# EAGLE design copy from (EAGLE 7.7.0)
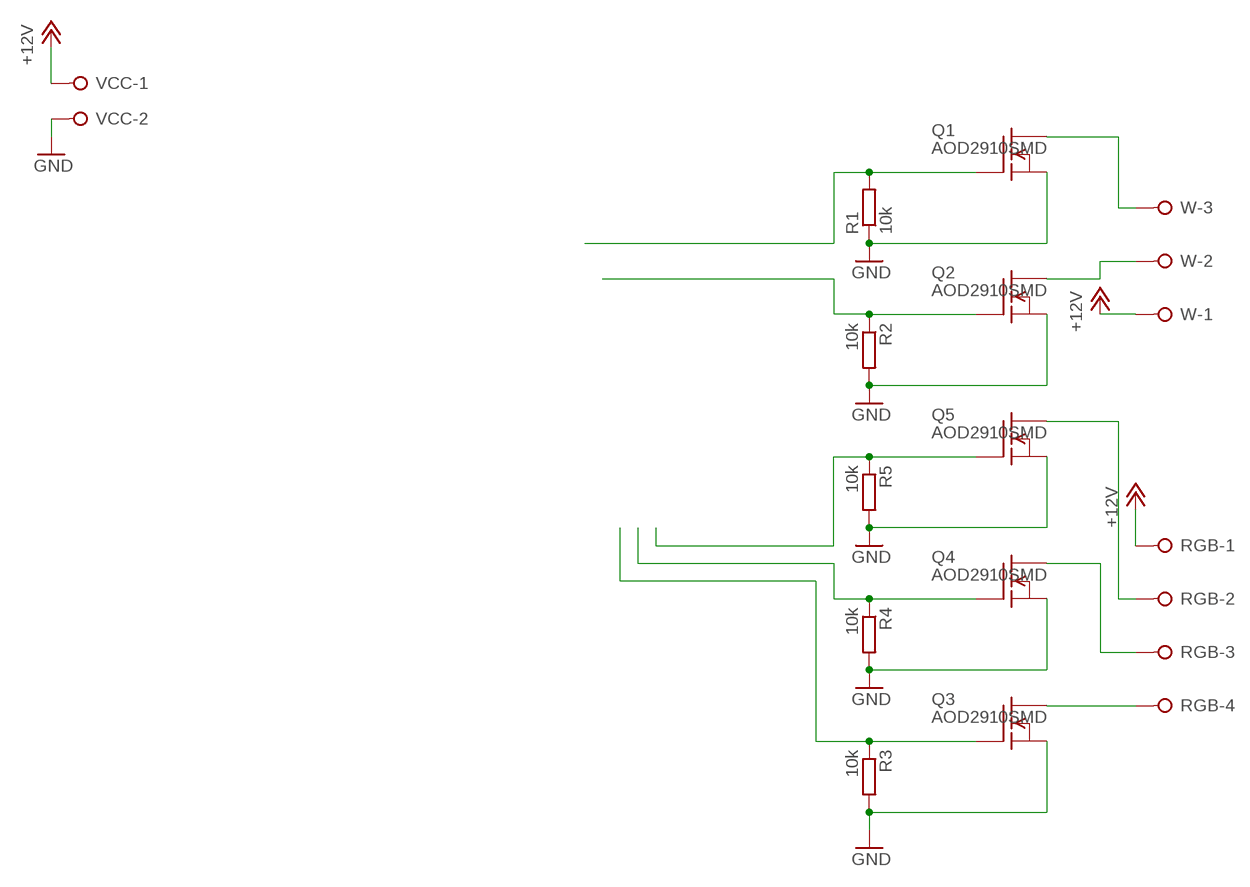
[diagram p0: schematic, sheet 1]

## Parts
Q1  AOD2910SMD  [DPAK-3]
Q2  AOD2910SMD  [DPAK-3]
Q3  AOD2910SMD  [DPAK-3]
Q4  AOD2910SMD  [DPAK-3]
Q5  AOD2910SMD  [DPAK-3]
R1  10k  R-EU_R0805  [R0805]
R2  10k  R-EU_R0805  [R0805]
R3  10k  R-EU_R0805  [R0805]
R4  10k  R-EU_R0805  [R0805]
R5  10k  R-EU_R0805  [R0805]
RGB  W237-04P  [W237-4P]
VCC  W237-02P  [W237-132]
W  W237-03P  [W237-133]

## Nets
+12V: RGB.1 VCC.1 W.1
B: Q3.4(D) RGB.4
CW: Q2.4(D) W.2
G: Q4.4(D) RGB.3
GND: Q1.3(S) Q2.3(S) Q3.3(S) Q4.3(S) Q5.3(S) R1.1 R2.2 R3.2 R4.2 R5.2 VCC.2
R: Q5.4(D) RGB.2
RGB-B: Q3.1(G) R3.1
RGB-CW: Q2.1(G) R2.1
RGB-G: Q4.1(G) R4.1
RGB-R: Q5.1(G) R5.1
RGB-WW [Signal]: Q1.1(G) R1.2
WW: Q1.4(D) W.3

## Library data of the parts
Q1-Q5 = transistor-fet+irf7201:AOD2910: N-Channel Enhancement MOSFET 100V; 32A; 0,024Ohm
R1-R5 = rcl:R-EU_: RESISTOR, European symbol
RGB = con-wago-508:W237-04P: WAGO SREW CLAMP; OC_FARNELL: unknown; OC_NEWARK: unknown
VCC = con-wago-508:W237-02P: WAGO SREW CLAMP; OC_FARNELL: unknown; OC_NEWARK: unknown
W = con-wago-508:W237-03P: WAGO SREW CLAMP; OC_FARNELL: unknown; OC_NEWARK: unknown

## Net classes
5 Signal: width 0.381 mm

## Board
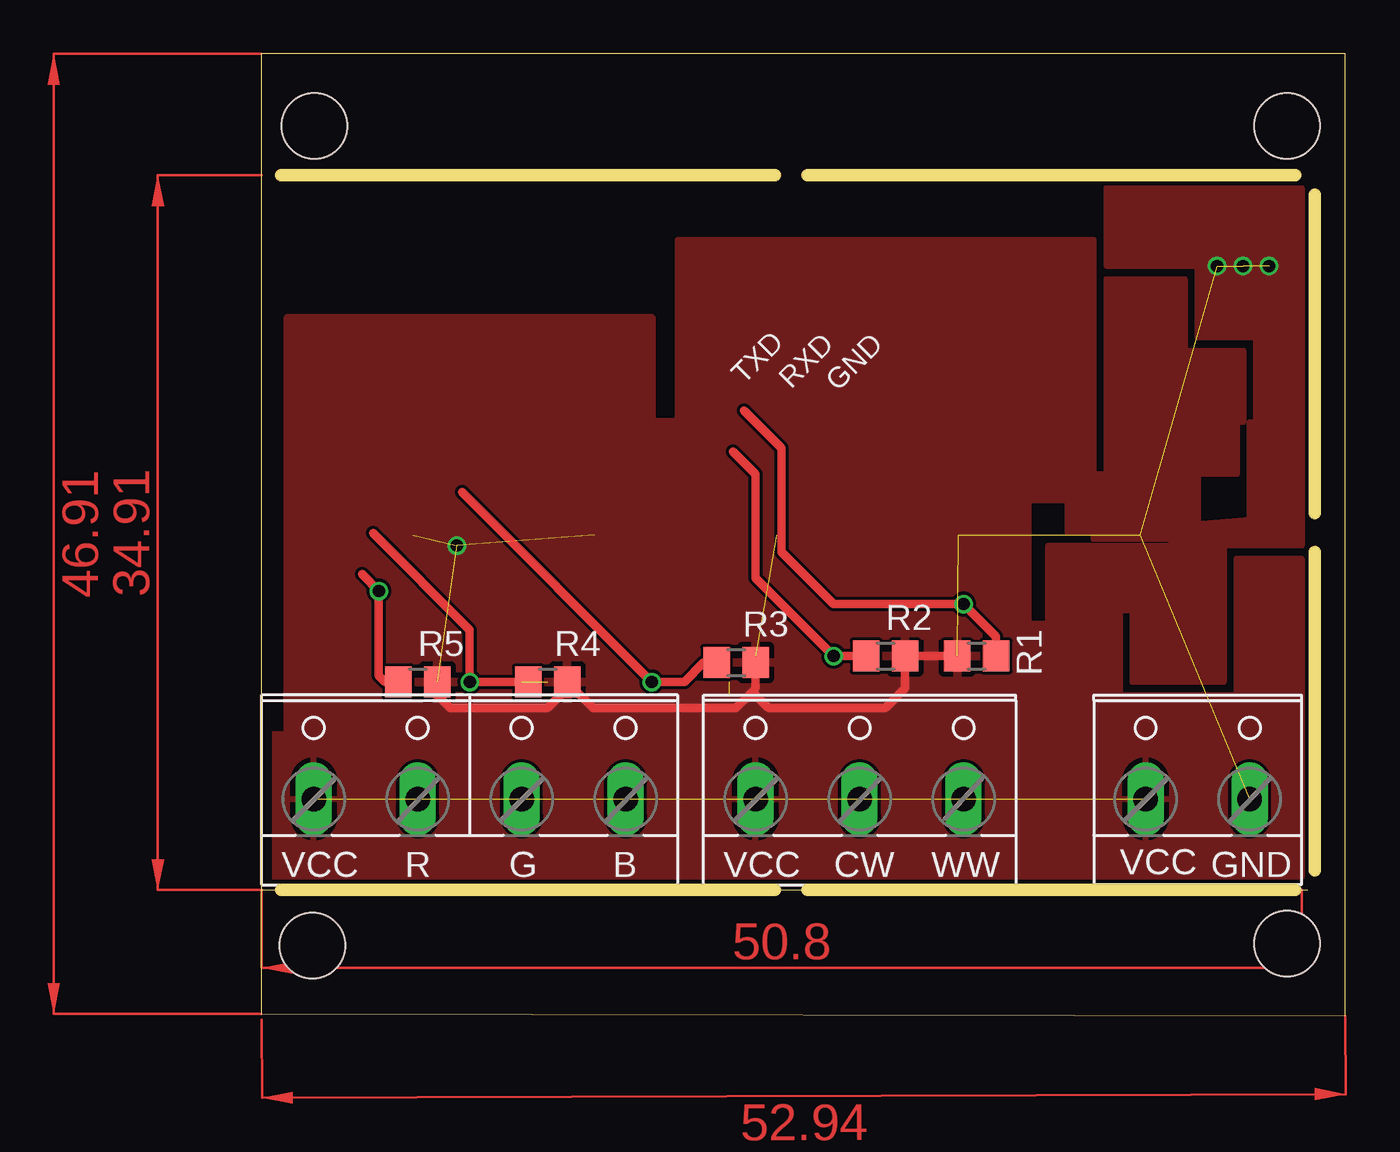
[diagram p1: board, top side]
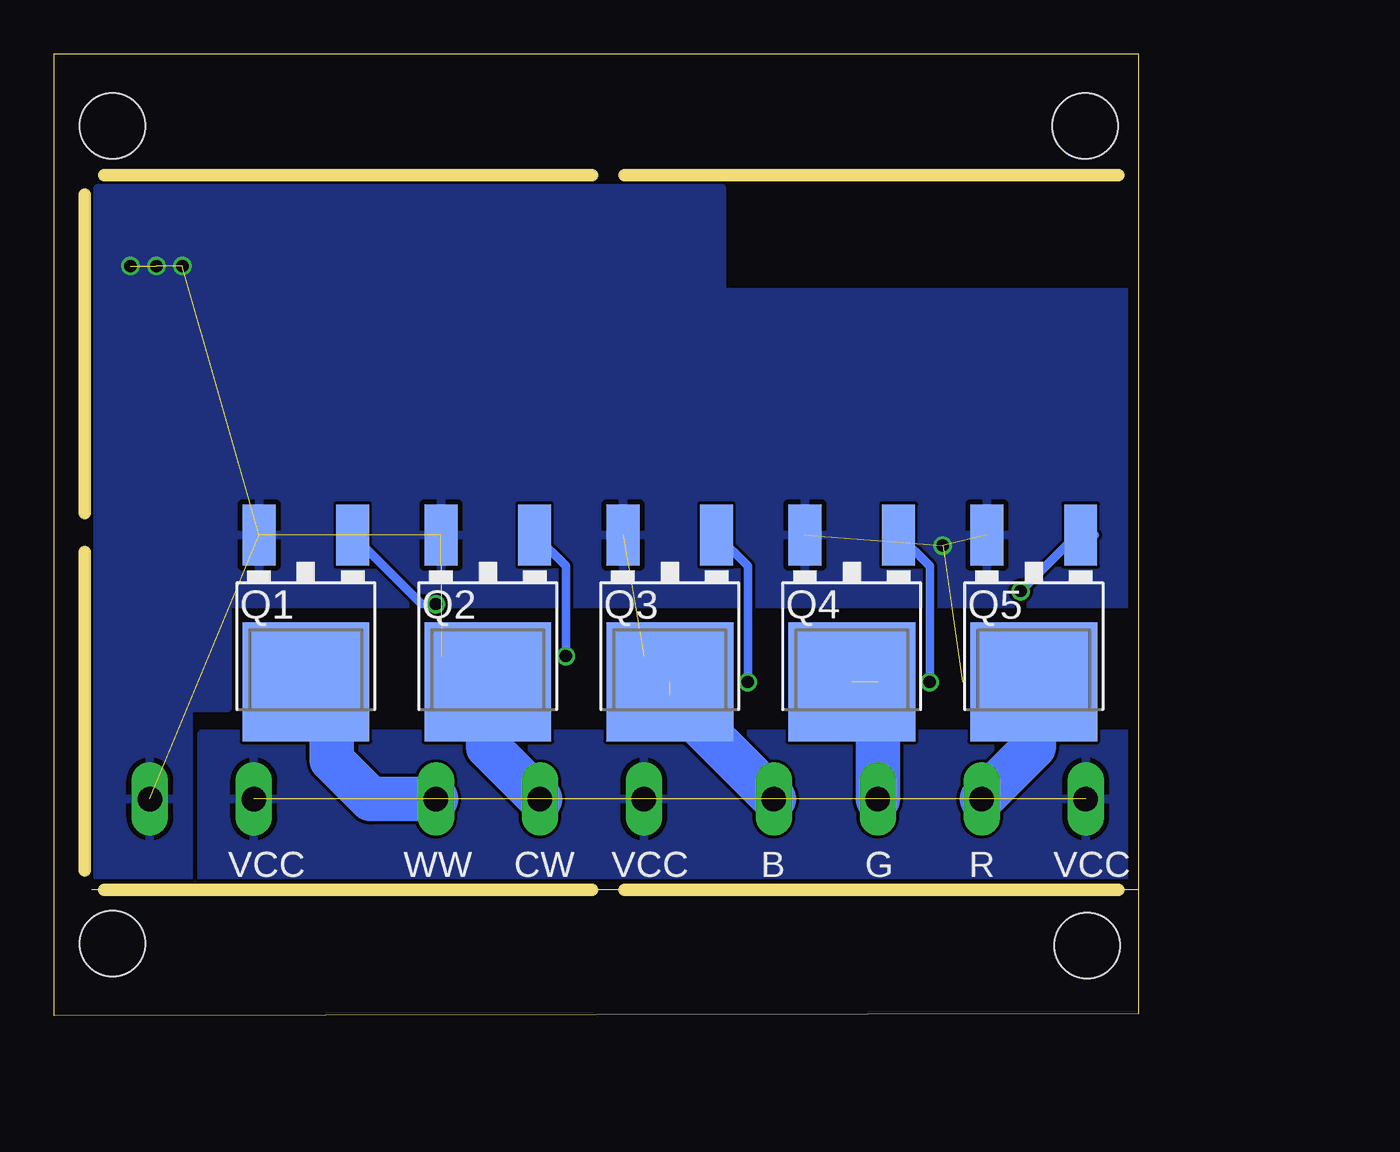
[diagram p2: board, bottom side, seen from below]

Size 52.97 x 47.01 mm. Coordinates in mm from the lower left corner, seen from the top.
Outline: 0.03,6.16 51.13,6.16
Outline: 52.97,0 52.97,47.01 0,47.01 0,0.1 52.97,0
Copper layers (1*16): Top 0.035mm / dielectric 1.6mm / Bottom 0.035mm
Design rules "Elecrow_2-layer_PCB_eagle_rule": minimum track width 6mil, minimum drill 12mil, track to track 6mil, track to pad 8mil, pad to pad 12mil, via to via 12mil, smd to smd 0mil, copper to edge 20mil, drill to drill 10mil, minimum pad ring 6mil, minimum via ring 6mil, stop-mask expansion 0mil, vias tented up to drill 100mil, thermal gap 10mil
Holes 3.2 mm at 50.13,3.54 50.13,43.49 2.61,43.49 2.51,3.44
Milling: 6 lines

### Footprints (pad centres in the part's own frame; a part is rotated, then mirrored left to right if it is on the bottom)
DPAK-3 = smd 1.6 x 3: 1 -2.286,-7.18; 3 2.286,-7.18 | smd 6.2 x 5.8: 4 0,0
R0805 = smd 1.3 x 1.5: 1 -0.95,0; 2 0.95,0
W237-4P = drill 1.194 long: 1 -7.62,-0.635; 2 -2.54,-0.635; 3 2.54,-0.635; 4 7.62,-0.635
W237-132 = drill 1.194 long: 1 -2.54,-0.635; 2 2.54,-0.635
W237-133 = drill 1.194 long: 1 -5.08,-0.635; 2 0,-0.635; 3 5.08,-0.635

### Placement (x,y rotation side)
Q1  40.67,16.32 180 bottom
Q2  31.78,16.32 180 bottom
Q3  22.89,16.32 180 bottom
Q4  14,16.32 180 bottom
Q5  5.11,16.32 180 bottom
R1  34.95,17.59 0 top
R2  30.51,17.59 0 top
R3  23.21,17.27 0 top
R4  14,16.32 0 top
R5  7.65,16.32 0 top
RGB  10.19,11.24 0 top
VCC  45.75,11.24 0 top
W  29.24,11.24 0 top

### Tracks (layer width: path | path; a pad name or v marks a point on that pad's centre or on a via)
+3V3
  pour Top: 37.49,18.54 37.49,25.21 40.67,25.21 40.67,37.91 20.35,37.91 20.35,18.54
+12V  (2 unrouted)
  pour Bottom: 0.03,6.16 0.03,13.78 45.75,13.78 45.75,6.16
  pour Top: 38.45,22.98 40.67,22.98 40.67,20.13 41.94,20.13 41.94,15.68 47.65,15.68 47.65,22.35 50.83,22.35 50.83,6.79 0.03,6.79 0.03,13.78 36.54,13.78 36.54,19.18 38.45,19.18
B  (1 unrouted)
  Bottom 2.184: 22.89,15.68 RGB.4
CW
  Bottom 2.184: Q2.4 31.78,13.14 W.2
G  (1 unrouted)
  Bottom 2.184: 12.73,16.32 RGB.3
GND  (via drill 0.6, 0.6 pad 0.41)  (10 unrouted)
  Top 0.406: 24.16,17.59 R3.2 24.16,16 24,15.84 | R1.1 R2.2 31.46,16 30.51,15.05 24.8,15.05 24,15.84 | R5.2 8.6,15.68 9.24,15.05 14,15.05 14.95,16 R4.2 16.22,15.05 23.21,15.05 24,15.84
  other vias: 46.7,36.64 9.56,22.98 47.97,36.64 49.24,36.64
  pour Bottom: 0.03,35.37 20.35,35.37 20.35,40.45 50.83,40.45 50.83,6.79 46.38,6.79 46.38,15.05 44.48,15.05 44.48,20.13 0.03,20.13
  pour Top: 40.35,22.67 40.35,22.98 44.48,22.98 44.48,23.94 48.29,24.25 48.29,29.02 48.61,29.02 48.61,33.15 45.75,33.15 45.75,36.64 41.3,36.64 41.3,40.45 50.83,40.45 50.83,22.98 47.02,22.98 47.02,16.32 42.57,16.32 42.57,19.81 40.67,19.81
  pour Top: 1.3,34.1 19.08,34.1 19.08,29.02 26.7,29.02 26.7,20.13 36.86,20.13 36.86,13.78 1.3,13.78
PH
  pour Top: 44.8,23.3 40.67,23.3 40.67,23.62 39.4,23.62 39.4,25.21 40.03,25.21 40.03,26.48 41.3,26.48 41.3,36 45.11,36 45.11,32.51 47.97,32.51 47.97,29.02 47.65,29.02 47.65,26.48 45.75,26.48 45.75,23.94 44.8,23.94
R
  Bottom 2.184: Q5.4 5.11,13.14 RGB.2
RGB-B  (via drill 0.6)
  Top 0.406: 9.81,25.59 v19.08,16.32 20.67,16.32 21.62,17.27 R3.1
  Bottom 0.406: v19.08,16.32 19.08,21.97 Q3.1
RGB-CW  (via drill 0.6)
  Top 0.406: 23.05,27.59 24.16,26.48 24.16,21.4 v27.97,17.59 R2.1
  Bottom 0.406: Q2.1 27.97,21.97 v27.97,17.59
RGB-G  (via drill 0.6 pad 0.41)
  Top 0.406: 5.46,23.59 10.19,18.86 v10.19,16.32 R4.1
  Bottom 0.406: Q4.1 10.19,21.97 v10.19,16.32
RGB-R  (via drill 0.6)
  Top 0.305: 6.06,16.32 R5.1
  Top 0.406: 4.92,21.59 v5.75,20.76 5.75,16.63 6.06,16.32
  Bottom 0.305: Q5.1 3.01,23.5
  Bottom 0.406: Q5.1 2.13,23.5 | 3.01,23.5 v5.75,20.76
RGB-WW  (via drill 0.6)
  Top 0.406: 23.59,29.59 25.43,27.75 25.43,22.67 27.97,20.13 v34.32,20.13 35.9,18.54 R1.2
  Bottom 0.406: Q1.1 35.01,20.13 v34.32,20.13
WW
  Bottom 2.184: W.3 37.49,10.6 39.4,12.51 39.4,15.05 Q1.4
(copper drawn outside any net)
  shapes: Top area x4

### Text on the board
tNames: TXD | RXD | GND | VCC | R | G | B | VCC | CW | WW | GND
bNames: VCC | R | G | B | VCC | CW | WW | VCC